# Altium project TB Teensy pcb.PrjPcb
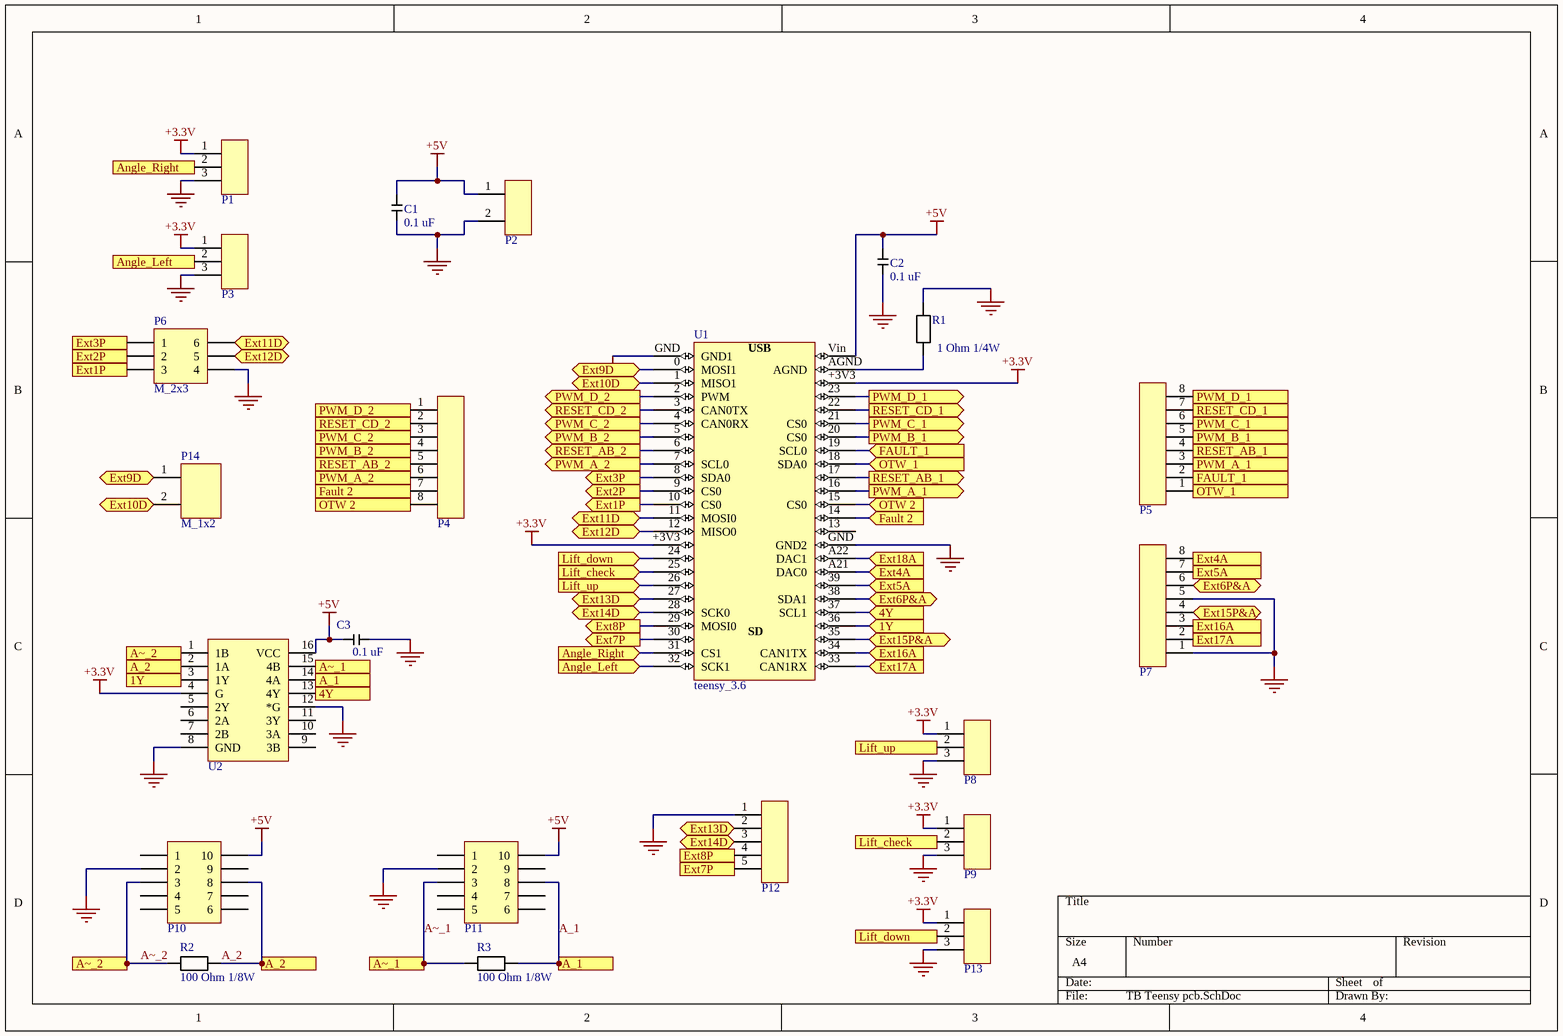
[diagram p0: TB Teensy pcb.SchDoc]
1 sheet, 22 parts. Net scope: flat (ports and power ports of the same name join across sheets).
Board file: TB Teensy pcb.PcbDoc

## Sheet TB Teensy pcb.SchDoc
size A4

### Parts
C1  value 0.1 uF  [C_SMD_0805_pcb]  (hidden comment: SMD)
C2  value 0.1 uF  [C_SMD_0805_pcb]  (hidden comment: SMD)
C3  value 0.1 uF  [C_SMD_0805_pcb]  (hidden comment: SMD)
P1  JST_SE_3PIN  [JST_SE_3PIN]  (value not drawn)
P2  JST_SE_2PIN  [JST_SE_2PIN]  (value not drawn)
P3  JST_SE_3PIN  [JST_SE_3PIN]  (value not drawn)
P4  JST_SE_8PIN  [JST_SE_8PIN]  (value not drawn)
P5  JST_SE_8PIN  [JST_SE_8PIN]  (value not drawn)
P6  M_2x3  [PIN_HEADER_M_2x3]
P7  JST_SE_8PIN  [JST_SE_8PIN]  (value not drawn)
P8  JST_SE_3PIN  [JST_SE_3PIN]  (value not drawn)
P9  JST_SE_3PIN  [JST_SE_3PIN]  (value not drawn)
P10  M_2x5  [PIN_HEADER_M_2x5]  (value not drawn)
P11  M_2x5  [PIN_HEADER_M_2x5]  (value not drawn)
P12  JST_SE_5PIN  [JST_SE_5PIN]  (value not drawn)
P13  JST_SE_3PIN  [JST_SE_3PIN]  (value not drawn)
P14  M_1x2  [PIN_HEADER_M_1x2]
R1  value 1 Ohm 1/4W  [R_SMD_0805_pcb]  (hidden comment: SMD)
R2  value 100 Ohm 1/8W  [R_SMD_0805_pcb]  (hidden comment: SMD)
R3  value 100 Ohm 1/8W  [R_SMD_0805_pcb]  (hidden comment: SMD)
U1  teensy_3.6  [teensy_3.6]
U2  AM26LS32ACDR  [AM26LS32ACDR]  (value not drawn)

### Ports
1Y (in), 1Y (out), 4Y (in), 4Y (out), A_1 (in), A_1 (out), A_2 (in), A_2 (out), Angle_Left (in), Angle_Left (out), Angle_Right (in), Angle_Right (out), A~_1 (in), A~_1 (out), A~_2 (in), A~_2 (out), Ext1P (in), Ext1P (out), Ext2P (in), Ext2P (out), Ext3P (in), Ext3P (out), Ext4A (in), Ext4A (out), Ext5A (in), Ext5A (out), Ext6P&A (bidir), Ext7P (in), Ext7P (out), Ext8P (in), Ext8P (out), Ext9D (bidir), Ext10D (bidir), Ext11D (bidir), Ext12D (bidir), Ext13D (bidir), Ext14D (bidir), Ext15P&A (bidir), Ext16A (in), Ext16A (out), Ext17A (in), Ext17A (out), Ext18A (in), Fault 2 (in), Fault 2 (out), FAULT_1 (in), FAULT_1 (out), Lift_check (in), Lift_check (out), Lift_down (in), Lift_down (out), Lift_up (in), Lift_up (out), OTW 2 (in), OTW 2 (out), OTW_1 (in), OTW_1 (out), PWM_A_1 (in), PWM_A_1 (out), PWM_A_2 (in), PWM_A_2 (out), PWM_B_1 (in), PWM_B_1 (out), PWM_B_2 (in), PWM_B_2 (out), PWM_C_1 (in), PWM_C_1 (out), PWM_C_2 (in), PWM_C_2 (out), PWM_D_1 (in), PWM_D_1 (out), PWM_D_2 (in), PWM_D_2 (out), RESET_AB_1 (in), RESET_AB_1 (out), RESET_AB_2 (in), RESET_AB_2 (out), RESET_CD_1 (in), RESET_CD_1 (out), RESET_CD_2 (in), RESET_CD_2 (out)

### Nets
+3.3V: P1.1 P3.1 P8.1 P9.1 P13.1 U1.+3V3 U2.4(G)
+5V: C1.1 C2.1 C3.2 P2.1 P10.10 P11.10 U1.Vin U2.16(VCC)
GND: C1.2 C2.2 C3.1 P1.3 P2.2 P3.3 P6.4 P7.1 P7.5 P8.3 P9.3 P10.2 P11.2 P12.1 P13.3 R1.1 U1.GND(GND1) U2.8(GND) U2.12(*G)
A_1: P11.8 R3.1 U2.14(4A) ; port A_1
A_2: P10.8 R2.1 U2.2(1A) ; port A_2
A~_1: P11.3 R3.2 U2.15(4B) ; port A~_1
A~_2: P10.3 R2.2 U2.1(1B) ; port A~_2
NetP1_2: P1.2 U1.31(CS1) ; port Angle_Right
NetP3_2: P3.2 U1.32(SCK1) ; port Angle_Left
NetP4_1: P4.1 U1.2(PWM) ; port PWM_D_2
NetP4_2: P4.2 U1.3(CAN0TX) ; port RESET_CD_2
NetP4_3: P4.3 U1.4(CAN0RX) ; port PWM_C_2
NetP4_4: P4.4 U1.5 ; port PWM_B_2
NetP4_5: P4.5 U1.6 ; port RESET_AB_2
NetP4_6: P4.6 U1.7(SCL0) ; port PWM_A_2
NetP4_7: P4.7 U1.14 ; port Fault 2
NetP4_8: P4.8 U1.15(CS0) ; port OTW 2
NetP5_1: P5.1 U1.18(SDA0) ; port OTW_1
NetP5_2: P5.2 U1.19(SCL0) ; port FAULT_1
NetP5_3: P5.3 U1.16 ; port PWM_A_1
NetP5_4: P5.4 U1.17 ; port RESET_AB_1
NetP5_5: P5.5 U1.20(CS0) ; port PWM_B_1
NetP5_6: P5.6 U1.21(CS0) ; port PWM_C_1
NetP5_7: P5.7 U1.22 ; port RESET_CD_1
NetP5_8: P5.8 U1.23 ; port PWM_D_1
NetP6_1: P6.1 U1.8(SDA0) ; port Ext3P
NetP6_2: P6.2 U1.9(CS0) ; port Ext2P
NetP6_3: P6.3 U1.10(CS0) ; port Ext1P
NetP6_5: P6.5 U1.12(MISO0) ; port Ext12D
NetP6_6: P6.6 U1.11(MOSI0) ; port Ext11D
NetP7_2: P7.2 U1.33(CAN1RX) ; port Ext17A
NetP7_3: P7.3 U1.34(CAN1TX) ; port Ext16A
NetP7_4: P7.4 U1.35 ; port Ext15P&A
NetP7_6: P7.6 U1.38(SDA1) ; port Ext6P&A
NetP7_7: P7.7 U1.39 ; port Ext5A
NetP7_8: P7.8 U1.A21(DAC0) ; port Ext4A
NetP8_2: P8.2 U1.26 ; port Lift_up
NetP9_2: P9.2 U1.25 ; port Lift_check
NetP12_2: P12.2 U1.27 ; port Ext13D
NetP12_3: P12.3 U1.28(SCK0) ; port Ext14D
NetP12_4: P12.4 U1.29(MOSI0) ; port Ext8P
NetP12_5: P12.5 U1.30 ; port Ext7P
NetP13_2: P13.2 U1.24 ; port Lift_down
NetP14_1: P14.1 U1.0(MOSI1) ; port Ext9D
NetP14_2: P14.2 U1.1(MISO1) ; port Ext10D
NetR1_2: R1.2 U1.AGND
NetU1_36: U1.36 U2.3(1Y) ; port 1Y
NetU1_37: U1.37(SCL1) U2.13(4Y) ; port 4Y
NetU1_A22: U1.A22(DAC1) ; port Ext18A

Not connected (* = marked no-connect by the designer): P10 1 4 5 6 7 9; P11 1 4 5 6 7 9; U1 13; U2 5(2Y) 6(2A) 7(2B) 9(3B) 10(3A) 11(3Y)

### Notes on the sheet
- (in symbol teensy_3.6) USB; SD

### Library data of the parts
C1-C3 = C_SMD_0805: Supplier 1: *; Supplier Part Number 1: *
P6 = PIN_HEADER_M_2x3: Supplier 1: *; Supplier Part Number 1: *
P10 P11 = PIN_HEADER_M_2x5: Supplier 1: *; Supplier Part Number 1: *
P14 = PIN_HEADER_M_1x2: Supplier 1: *; Supplier Part Number 1: *
R1-R3 = R_SMD_0805: Supplier 1: *; Supplier Part Number 1: *
U2 = AM26LS32ACDR: IC QUAD DIFF LINE RCVR 16-SOIC; Manufacturer 1: Texas Instruments; Data Rate: 10Mbps; Number of Receivers: 4; Operating Supply Voltage: 5V; Max Supply Voltage: 5.25V; Min Supply Voltage: 4.75V; Nominal Supply Current: 70mA; Logic Function: Receiver; Current Rating: 8A; ESD Protection: No; Supplier 1: Digi-Key; Supplier Part Number 1: 296-1011-1-ND; Manufacturer Part Number 1: AM26LS32ACDR; Stock 1: 24922; Pricing 1: 1=0,66000, 10=0,57800, 25=0,54280, 100=0,41150, 250=0,35020, 500=0,33270, 1000=0,25390 (USD); RoHS: Yes; Case/Package: D; Number of Pins: 16; Weight: 0.004998oz; Contact Plating: Gold; Min Operating Temperature: 0°C; Max Operating Temperature: 70°C; Packaging: Tape and Reel; Package Quantity: 1; Operating Supply Current: 70mA; Number of Drivers: 4; Max Supply Current: 70mA; Length: 9.9mm; Height: 1.58mm; Width: 3.91mm; Radiation Hardening: No; REACH SVHC: No SVHC; Lead Free: Lead Free; ComponentLink1URL: https://datasheet.ciiva.com/3028/slls115e-3028016.pdf?src-supplier=Avnet; ComponentLink1Description: https://datasheet.ciiva.com/3028/slls115e-3028016.pdf?src-supplier=Avnet; ComponentLink2URL: https://datasheet.ciiva.com/1156/am26ls33a-1156901.pdf?src-supplier=Newark; ComponentLink2Description: https://datasheet.ciiva.com/1156/am26ls33a-1156901.pdf?src-supplier=Newark; ComponentLink3URL: https://datasheet.ciiva.com/26831/am26ls32acdr-26831645.pdf?src-supplier=IIIC; ComponentLink3Description: https://datasheet.ciiva.com/26831/am26ls32acdr-26831645.pdf?src-supplier=IIIC; ComponentLink4URL: https://datasheet.ciiva.com/1700/am26ls32a-1700817.pdf?src-supplier=Digi-Key; ComponentLink4Description: https://datasheet.ciiva.com/1700/am26ls32a-1700817.pdf?src-supplier=Digi-Key; ComponentLink5URL: https://datasheet.ciiva.com/1700/am26ls32a-1700818.pdf?src-supplier=Digi-Key; ComponentLink5Description: https://datasheet.ciiva.com/1700/am26ls32a-1700818.pdf?src-supplier=Digi-Key; ComponentLink6URL: https://datasheet.ciiva.com/3028/am26ls32a-3028146.pdf?src-supplier=Avnet; ComponentLink6Description: https://datasheet.ciiva.com/3028/am26ls32a-3028146.pdf?src-supplier=Avnet; ComponentLink7URL: https://datasheet.ciiva.com/1700/am26ls32a-1700819.pdf?src-supplier=Digi-Key; ComponentLink7Description: https://datasheet.ciiva.com/1700/am26ls32a-1700819.pdf?src-supplier=Digi-Key; ComponentLink8URL: https://datasheet.ciiva.com/26240/am26ls32a-26240838.pdf?src-supplier=Avnet+Europe; ComponentLink8Description: https://datasheet.ciiva.com/26240/am26ls32a-26240838.pdf?src-supplier=Avnet+Europe; ComponentLink9URL: https://datasheet.ciiva.com/46396/1862380-46396475.pdf?src-supplier=Element14; ComponentLink9Description: https://datasheet.ciiva.com/46396/1862380-46396475.pdf?src-supplier=Element14; ComponentLink10URL: https://datasheet.ciiva.com/8064/1862380-8064734.pdf?src-supplier=Element14; ComponentLink10Description: https://datasheet.ciiva.com/8064/1862380-8064734.pdf?src-supplier=Element14; ComponentLink11URL: https://datasheet.ciiva.com/48709/001047720-da-01-en-ic-4x-dff-ln-rc-am26ls32acdr-soic-16-tid-48709254.pdf?src-supplier=Conrad; ComponentLink11Description: https://datasheet.ciiva.com/48709/001047720-da-01-en-ic-4x-dff-ln-rc-am26ls32acdr-soic-16-tid-48709254.pdf?src-supplier=Conrad
P1 P3 P8 P9 P13 = JST_SE_3PIN: Supplier Part Number 1: *; Supplier 1: *
P2 = JST_SE_2PIN: Supplier 1: *; Supplier Part Number 1: *
P4 P5 P7 = JST_SE_8PIN: Supplier 1: *; Supplier Part Number 1: *; Category: Pin Header
P12 = JST_SE_5PIN: Supplier 1: *; Supplier Part Number 1: *